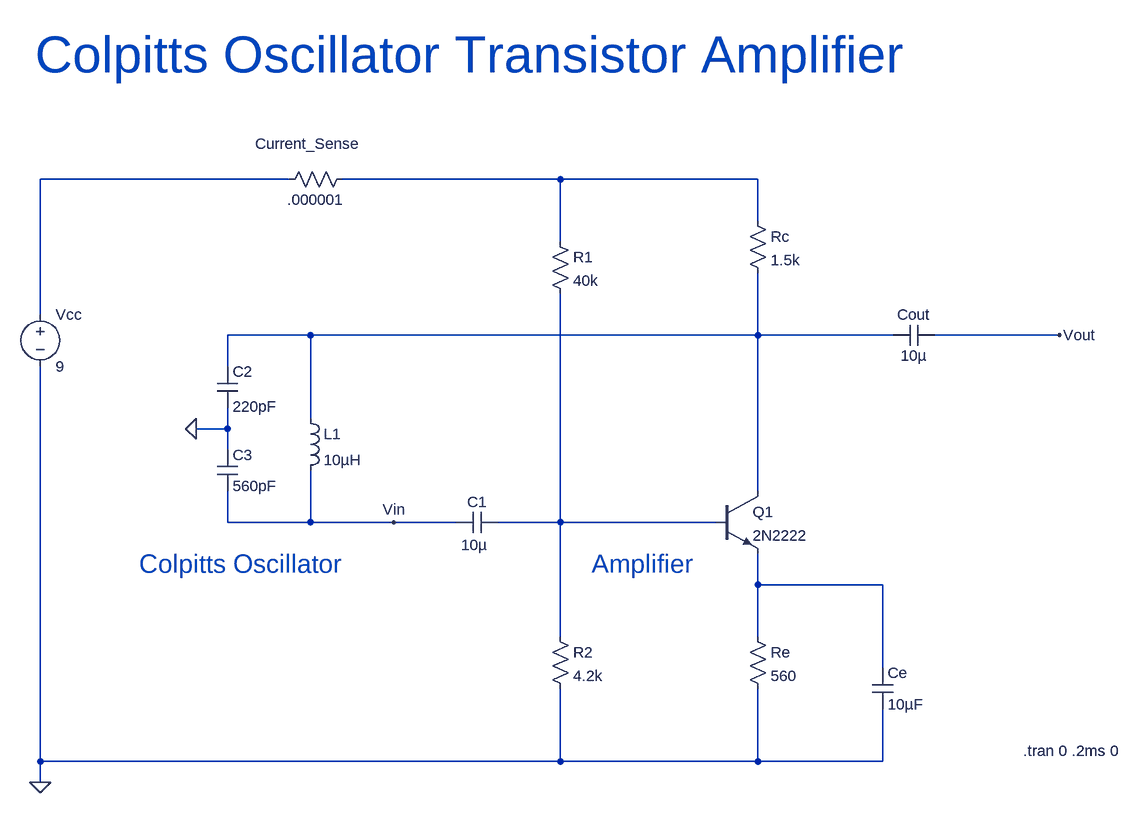
[diagram p0: schematic Schematic.asc]
Schematic.asc, the LTspice schematic file:
Version 4
SHEET 1 1932 680
WIRE 336 -1120 -48 -1120
WIRE 752 -1120 416 -1120
WIRE 1056 -1120 752 -1120
WIRE 1056 -1056 1056 -1120
WIRE 752 -1024 752 -1120
WIRE -48 -912 -48 -1120
WIRE 368 -880 240 -880
WIRE 1056 -880 1056 -976
WIRE 1056 -880 368 -880
WIRE 1264 -880 1056 -880
WIRE 1520 -880 1328 -880
WIRE 240 -832 240 -880
WIRE 368 -752 368 -880
WIRE 240 -736 240 -768
WIRE 240 -736 192 -736
WIRE 240 -704 240 -736
WIRE 1056 -640 1056 -880
WIRE 240 -592 240 -640
WIRE 368 -592 368 -672
WIRE 368 -592 240 -592
WIRE 496 -592 368 -592
WIRE 592 -592 496 -592
WIRE 752 -592 752 -944
WIRE 752 -592 656 -592
WIRE 992 -592 752 -592
WIRE 1056 -496 1056 -544
WIRE 1248 -496 1056 -496
WIRE 752 -416 752 -592
WIRE 1056 -416 1056 -496
WIRE 1248 -368 1248 -496
WIRE -48 -224 -48 -832
WIRE 752 -224 752 -336
WIRE 752 -224 -48 -224
WIRE 1056 -224 1056 -336
WIRE 1056 -224 752 -224
WIRE 1248 -224 1248 -304
WIRE 1248 -224 1056 -224
WIRE -48 -192 -48 -224
FLAG -48 -192 0
FLAG 1520 -880 Vout
FLAG 496 -592 Vin
FLAG 192 -736 0
SYMBOL npn 992 -640 R0
SYMATTR InstName Q1
SYMATTR Value 2N2222
SYMBOL voltage -48 -928 R0
WINDOW 123 0 0 Left 0
WINDOW 39 0 0 Left 0
SYMATTR InstName Vcc
SYMATTR Value 9
SYMBOL res 1040 -432 R0
SYMATTR InstName Re
SYMATTR Value 560
SYMBOL res 1040 -1072 R0
SYMATTR InstName Rc
SYMATTR Value 1.5k
SYMBOL res 736 -432 R0
SYMATTR InstName R2
SYMATTR Value 4.2k
SYMBOL res 736 -1040 R0
SYMATTR InstName R1
SYMATTR Value 40k
SYMBOL cap 1328 -896 R90
WINDOW 0 0 32 VBottom 2
WINDOW 3 32 32 VTop 2
SYMATTR InstName Cout
SYMATTR Value 10µ
SYMBOL res 432 -1136 R90
WINDOW 0 -23 68 VBottom 2
WINDOW 3 32 56 VTop 2
SYMATTR InstName Current_Sense
SYMATTR Value .000001
SYMBOL cap 1232 -368 R0
SYMATTR InstName Ce
SYMATTR Value 10µF
SYMBOL cap 656 -608 R90
WINDOW 0 0 32 VBottom 2
WINDOW 3 35 36 VTop 2
SYMATTR InstName C1
SYMATTR Value 10µ
SYMBOL cap 224 -832 R0
WINDOW 3 24 62 Left 2
SYMATTR Value 220pF
SYMATTR InstName C2
SYMBOL cap 224 -704 R0
SYMATTR InstName C3
SYMATTR Value 560pF
SYMBOL ind 352 -768 R0
SYMATTR InstName L1
SYMATTR Value 10µH
TEXT 1464 -240 Left 2 !.tran 0 .2ms 0
TEXT -56 -1312 Left 6 ;Colpitts Oscillator Transistor Amplifier
TEXT 800 -528 Left 4 ;Amplifier
TEXT 104 -528 Left 4 ;Colpitts Oscillator

The netlist it stands for:
* Schematic.asc
Q1 N003 N004 N005 0 2N2222
Vcc N001 0 9
Re N005 0 560
Rc N002 N003 1.5k
R2 N004 0 4.2k
R1 N002 N004 40k
Cout Vout N003 10µ
R§Current_Sense N002 N001 .000001
Ce N005 0 10µF
C1 N004 Vin 10µ
C2 N003 0 220pF
C3 0 Vin 560pF
L1 N003 Vin 10µH
.model NPN NPN
.model PNP PNP
.lib standard.bjt
.tran 0 .2ms 0
* Colpitts Oscillator Transistor Amplifier
* Amplifier
* Colpitts Oscillator
.backanno
.end